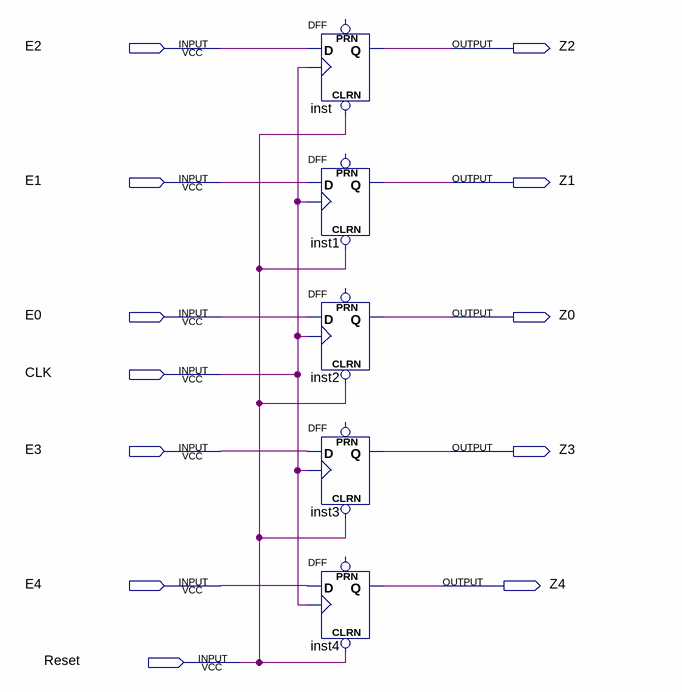
[diagram p0: schematic sheet]
// Quartus schematic Registrador4bits.bdf as structural Verilog: 5 symbols, 12 pins
module Registrador4bits (
  input  E2,
  input  E1,
  input  E0,
  input  CLK,
  input  E3,
  input  E4,
  input  Reset,
  output Z2,
  output Z1,
  output Z0,
  output Z3,
  output Z4
);

  DFF inst (.CLRN(Reset), .CLK(CLK), .D(E2), .Q(Z2));  // open: PRN
  DFF inst1 (.CLRN(Reset), .CLK(CLK), .D(E1), .Q(Z1));  // open: PRN
  DFF inst2 (.CLRN(Reset), .CLK(CLK), .D(E0), .Q(Z0));  // open: PRN
  DFF inst3 (.CLRN(Reset), .CLK(CLK), .D(E3), .Q(Z3));  // open: PRN
  DFF inst4 (.CLRN(Reset), .CLK(CLK), .D(E4), .Q(Z4));  // open: PRN
endmodule
